# Altium schematic sheet 0007-Optical_Tracker.schlib.schdoc
size A
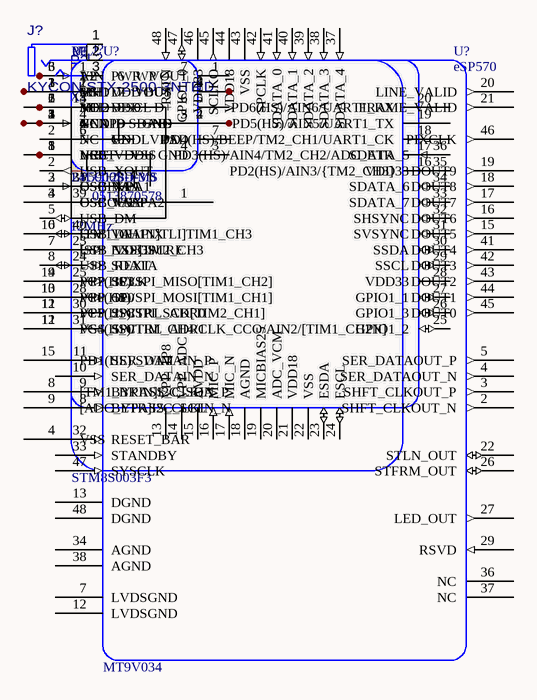
[diagram p0: 0007-Optical_Tracker.schlib.schdoc]

## Parts
(Parts that share a designator on the sheet are numbered #1, #2 ... from top to bottom, then left to right.)
C?  0.1uF  [CAP_CERAMIC_0402]
J?#1  0513870578  [0513870578]
J?#2  KYCON STX-2500-3NTR  [KYCON_STX2500]
L?  BLM18KG221SN1D  [INDUCTOR_0603]
ML?  CMT103  [CMT103]  (no BOM)
P?  Header 5X2A  [HDR2X5_CEN]  (no BOM)
R?  10K  [RESISTOR_0402]
TP?  TEST POINT  [TEST_POINT_PAD]  (value not drawn)  (no BOM)
U?#1  eSP570  [LQFP-48_M]
U?#2  TSOP6156
U?#3  TSOP6456
U?#4  ESDR0502N  (no BOM)
U?#5  STM8S003F3
U?#6  24LC128-I/MS  [MSOP-MS8_N]
U?#7  LP5900SD-3.3  [LLP-6]
U?#8  MT9V034  [CLCC-48]
X?  12MHz  [4-SMD]

## Nets
NetJ?#1_1: J?#1.1(PWR) L?.1
NetL?_2: L?.2 P?.6
NetML?_1: ML?.1(MH1) P?.2
NetML?_2: ML?.2(MH2) P?.3 U?#6.1(NC)
NetP?_1: P?.1 U?#6.3(A2) U?#7.6(VIN)
NetP?_4: P?.4 U?#6.2(NC) U?#7.4(VEN)
NetP?_5: P?.5 U?#7.2(NC)
NetR?_1: R?.1 TP?.1
NetU?#1_1: U?#1.1(USB_VDDU) U?#6.8(VCC) U?#7.5(NC)
NetU?#1_35: U?#1.35(VDD33) U?#5.16(PD2(HS)/AIN3/{TM2_CH3])
NetU?#1_36: U?#1.36(SDATA_5) U?#5.17(PD3(HS)/AIN4/TM2_CH2/ADC_ETR)
NetU?#2_1: U?#2.1(GND) U?#3.1(GND) U?#4.3(NC) U?#5.5(VCAP) X?.2
NetU?#2_2: U?#2.2(GND) U?#3.2(NC) U?#4.4(D-)
NetU?#2_3: U?#2.3(VS) U?#3.3(VS) U?#4.1(GND)
NetU?#2_4: U?#2.4(OUT) U?#3.4(OUT) U?#4.6(VBUS)
NetU?#4_2: U?#4.2(NC) U?#5.6(VDD)
NetU?#5_3: U?#5.3(OSCOUT/PA2) X?.4

Not connected (* = marked no-connect by the designer): C? 1 2; J?#1 2(D-) 3(D+) 4(ID) 5(GND) 6(SHIELD) 7(SHIELD) 8(SHIELD) 9(SHIELD); J?#2 1 2 3; P? 7 8 9 10; R? 2; U?#1 2(USB_XOUT) 3(USB_XIN) 4(USB_VSSP) 5(USB_DM) 6(USB_DP) 7(USB_VD33P) 8(USB_REXT) 9(VPP_3P3) 10(VPP_5P0) 11(VPP_2P8) 12(VSS_5P0) 13(VPP_1P8) 14(VPP_ADC) 15(AVDD) 16(MIC_P) 17(MIC_N) 18(AGND) 19(MICBIAS25) 20(ADC_VCM) 21(VDD18) 22(VSS) 23(ESDA) 24(ESCL) 25(GPIO1_2) 26(GPIO1_3) 27(GPIO1_1) 28(VDD33) 29(SSCL) 30(SSDA) 31(SVSYNC) 32(SHSYNC) 33(SDATA_7) 34(SDATA_6) 37(SDATA_4) 38(SDATA_3) 39(SDATA_2) 40(SDATA_1) 41(SDATA_0) 42(SPCLK) 43(VSS) 44(VDD18) 45(SCLKO) 46(VDD33) 47(GPIO1_0) 48(RSTN); U?#4 5(D+); U?#5 1(NRST) 2(OSCIN/PA1) 4(VSS) 7([SPI_NSS]TM2_CH3) 8([TM1_BKIN]I2C_SDA) 9([ADC_ETR]I2C_SCL) 10([TM1_CH1N]TLI]TIM1_CH3) 11(PC4(HS)/TIM_CH4/CLK_CCO/AIN2/[TIM1_CH2N]) 12(PC5(HS)/SPI_SCK[TIM2_CH1]) 13(PC6(HS)/SPI_MOSI[TIM1_CH1]) 14(PC7(HS)/SPI_MISO[TIM1_CH2]) 15(PD1(HS)/SWIM) 18(PD4(HS)/BEEP/TM2_CH1/UART1_CK) 19(PD5(HS)/AIN5/UART1_TX) 20(PD6(HS)/AIN6/UART1_RX); U?#6 4(VSS) 5(SDA) 6(SCL) 7(WP); U?#7 1(VOUT) 3(GND) 7(PAD); U?#8 1(VDD) 2(SHFT_CLKOUT_N) 3(SHFT_CLKOUT_P) 4(SER_DATAOUT_N) 5(SER_DATAOUT_P) 6(VDDLVDS) 7(LVDSGND) 8(BYPASS_CLKIN_N) 9(BYPASS_CLKIN_P) 10(SER_DATAIN_N) 11(SER_DATAIN_P) 12(LVDSGND) 13(DGND) 14(VDD) 15(DOUT5) 16(DOUT6) 17(DOUT7) 18(DOUT8) 19(DOUT9) 20(LINE_VALID) 21(FRAME_VALID) 22(STLN_OUT) 23(EXPOSURE) 24(SDATA) 25(SCLK) 26(STFRM_OUT) 27(LED_OUT) 28(OE) 29(RSVD) 30(S_CTRL_ADR0) 31(S_CTRL_ADR1) 32(RESET_BAR) 33(STANDBY) 34(AGND) 35(VAA) 36(NC) 37(NC) 38(AGND) 39(VAA) 40(VAAPIX) 41(DOUT4) 42(DOUT3) 43(DOUT2) 44(DOUT1) 45(DOUT0) 46(PIXCLK) 47(SYSCLK) 48(DGND); X? 1 3

## Library data of the parts
C? = CAP, CERAMIC: CAP CER 0.1UF 6.3V 20% X5R 0402; Supplier 1: Digi-Key; Supplier Part Number 1: 399-8944-1-ND
J?#1 = 0513870578: CONN RECEPT MINIUSB R/A 5POS SMD; Supplier 1: Digi-Key; Supplier Part Number 1: WM5462CT-ND
J?#2 = AUDIO_JACK_3P: Manufacturer: *; ManufacturerPN: KYCON STX-2500-3NTR; Supplier 1: Mouser; Supplier Part Number 1: 806-STX-2500-3NTR
L? = INDUCTOR: FERRITE CHIP 220 OHM 2200MA 0603; Manufacturer: Murata; Part Number: BLM18KG221SN1D; Package: 0603; Supplier 1: Digi-Key; Supplier Part Number 1: 490-5255-1-ND
ML? = CMT103: Lens holder, M12x0.5, 16.2, centered; Part Number: CMT103
P? = Header 5X2A: Header, 5-Pin, Dual row
R? = RESISTOR: RES 10K OHM 1/10W 1% 0402 SMD; Supplier 1: Digi-Key; Supplier Part Number 1: P10.0KLCT-ND
TP? = TEST_POINT: Manufacturer: *; Part Number: *
U?#1 = eSP570: USB 2.0 Camera Bridge Controller
U?#4 = ESDR0502N: TVS ARRAY LOW CAP 6UDFN; Supplier 1: Digi-Key; Supplier Part Number 1: ESDR0502NMUTBGOSCT-ND
U?#6 = 24LC128-I/MS: 128Kbit, 400kHz, 2.5V, I2C Serial EEPROM, 8-Pin MSOP, Industrial Temperature; Published: 29-Jan-2009; DatasheetVersion: revR, Apr-2009; PackageVersion: revBB, Aug-2009; PackageReference: MSOP-MS8; Publisher: Altium Limited; PackageDescription: 8-Lead Plastic Micro Small Outline Package (MS) [MSOP]; Supplier 1: Digi-Key; Supplier Part Number 1: 24LC128-I/MS-ND; ComponentLink1Description: Datasheet; ComponentLink1URL: http://ww1.microchip.com/downloads/en/DeviceDoc/21191R.pdf; ComponentLink2Description: Packaging Specification; ComponentLink2URL: http://www.microchip.com/stellent/groups/techpub_sg/documents/packagingspec/en012702.pdf; ComponentLink3Description: Microchip.com Home; ComponentLink3URL: http://www.microchip.com/
U?#7 = LP5900SD-3.3: IC, LINEAR REGULATOR, 3.3V, 150MA, ULTRA LOW NOISE; Manufacturer: NATIONAL SEMICONDUCTOR; Part Number: LP5900SD-3.3/NOPB; Pinout verified: *; Supplier 1: Digi-Key; Supplier Part Number 1: LP5900SD-3.3/NOPBCT-ND
U?#8 = MT9V034_DS_D: 1/3" WVGA 60FPS CMOS Digital Image Sensor Global Shutter; Part Number: MT9V034C12STC; Supplier 1: Digi-Key; Supplier Part Number 1: 557-1454-ND
X? = 405C35E24M00000: CRYSTAL 12MHZ 20PF SMD; Supplier 1: Digi-Key; Supplier Part Number 1: CTX819CT-ND
U?#5 = STM8S003F3: Supplier 1: Digi-Key; Supplier Part Number 1: 497-11946-5-ND